# Altium schematic sheet VGA.SchDoc
size A; SheetNumber: 1; SheetTotal: 5
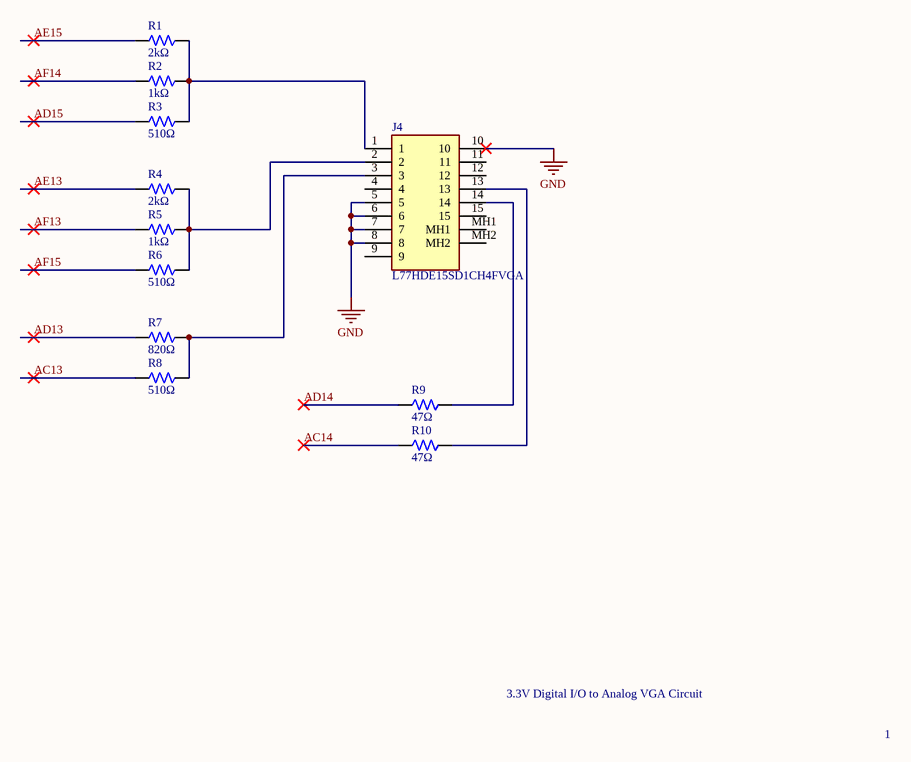
[diagram p0: VGA.SchDoc]

## Parts
J4  L77HDE15SD1CH4FVGA  [L77HDE15SD1CH4FVGA]
R1  Resistance: 2kΩ  [RES-0402]  (hidden comment: 0402WGF2001TCE)
R2  Resistance: 1kΩ  [RES-0402]  (hidden comment: 0402WGF1001TCE)
R3  Resistance: 510Ω  [RES-0402]  (hidden comment: 0402WGF5100TCE)
R4  Resistance: 2kΩ  [RES-0402]  (hidden comment: 0402WGF2001TCE)
R5  Resistance: 1kΩ  [RES-0402]  (hidden comment: 0402WGF1001TCE)
R6  Resistance: 510Ω  [RES-0402]  (hidden comment: 0402WGF5100TCE)
R7  Resistance: 820Ω  [RES-0603]  (hidden comment: 0603WAF8200T5E)
R8  Resistance: 510Ω  [RES-0402]  (hidden comment: 0402WGF5100TCE)
R9  Resistance: 47Ω  [RES-0603]  (hidden comment: 0603WAF470JT5E)
R10  Resistance: 47Ω  [RES-0603]  (hidden comment: 0603WAF470JT5E)

## Nets
GND: J4.5 J4.6 J4.7 J4.8 J4.10
AC13: R8.1
AC14: R10.1
AD13: R7.1
AD14: R9.1
AD15: R3.1
AE13: R4.1
AE15: R1.1
AF13: R5.1
AF14: R2.1
AF15: R6.1
NetJ4_1: J4.1 R1.2 R2.2 R3.2
NetJ4_2: J4.2 R4.2 R5.2 R6.2
NetJ4_3: J4.3 R7.2 R8.2
NetJ4_13: J4.13 R10.2
NetJ4_14: J4.14 R9.2

Not connected (* = marked no-connect by the designer): J4 4 9 11 12 15 MH1 MH2

## Notes on the sheet
- 3.3V Digital I/O to Analog VGA Circuit
- 1

## Library data of the parts
J4 = L77HDE15SD1CH4FVGA: Connector; Manufacturer_Name: Amphenol Communications Solutions; Datasheet Link: https://cdn.amphenol-cs.com/media/wysiwyg/files/drawing/l77hde15sd1ch4fvga.pdf; Height: 12.85mm; Manufacturer_Part_Number: L77HDE15SD1CH4FVGA; Mouser Part Number: 523-7HDE15SD1CH4FVGA; Mouser Price/Stock: https://www.mouser.co.uk/ProductDetail/Amphenol-Commercial-Products/L77HDE15SD1CH4FVGA?qs=ToP8pWlZ0bNtQSp9f8k5Rw%3D%3D; Arrow Part Number: L77HDE15SD1CH4FVGA; Arrow Price/Stock: https://www.arrow.com/en/products/l77hde15sd1ch4fvga/amphenol-fci?region=nac
R1 R4 = 0402WGF2001TCE: Resistor, 2kΩ, ±1%, 62.5mW, 50V, ±100ppm/℃, -55℃~+155℃, SMD 0402; Manufacturer: Uniroyal; Supplier 1: LCSC; Manufacturer Part Number: 0402WGF2001TCE; Supplier Part Number 1: C4109; JLCPCB Part Number: C4109; Power Rating: 62.5mW; Category: Resistors; Package Size: 0402; JLCPCB Basic Part: Yes; Tolerance: ±1%; Voltage Rating: 50V; Temperature Coefficient: ±100ppm/℃; Temperature Rating: -55℃~+155℃; ComponentLink1Description: Datasheet; ComponentLink1URL: https://wmsc.lcsc.com/wmsc/upload/file/pdf/v2/lcsc/2206010230_UNI-ROYAL-Uniroyal-Elec-0402WGF2001TCE_C4109.pdf; ComponentLink2Description: JLCPCB Part URL; ComponentLink2URL: https://jlcpcb.com/partdetail/C4109
R2 R5 = 0402WGF1001TCE: Resistor, 1kΩ, ±1%, 62.5mW, 50V, ±100ppm/℃, -55℃~+155℃, SMD 0402; Manufacturer: Uniroyal; Supplier 1: LCSC; Manufacturer Part Number: 0402WGF1001TCE; Supplier Part Number 1: C11702; JLCPCB Part Number: C11702; Power Rating: 62.5mW; Category: Resistors; Package Size: 0402; JLCPCB Basic Part: Yes; Tolerance: ±1%; Voltage Rating: 50V; Temperature Coefficient: ±100ppm/℃; Temperature Rating: -55℃~+155℃; ComponentLink1Description: Datasheet; ComponentLink1URL: https://wmsc.lcsc.com/wmsc/upload/file/pdf/v2/lcsc/2206010216_UNI-ROYAL-Uniroyal-Elec-0402WGF1001TCE_C11702.pdf; ComponentLink2Description: JLCPCB Part URL; ComponentLink2URL: https://jlcpcb.com/partdetail/C11702
R3 R6 R8 = 0402WGF5100TCE: Resistor, 510Ω, ±1%, 62.5mW, 50V, ±100ppm/℃, -55℃~+155℃, SMD 0402; Manufacturer: Uniroyal; Supplier 1: LCSC; Manufacturer Part Number: 0402WGF5100TCE; Supplier Part Number 1: C25123; JLCPCB Part Number: C25123; Power Rating: 62.5mW; Category: Resistors; Package Size: 0402; JLCPCB Basic Part: Yes; Tolerance: ±1%; Voltage Rating: 50V; Temperature Coefficient: ±100ppm/℃; Temperature Rating: -55℃~+155℃; ComponentLink1Description: Datasheet; ComponentLink1URL: https://wmsc.lcsc.com/wmsc/upload/file/pdf/v2/lcsc/2205311900_UNI-ROYAL-Uniroyal-Elec-0402WGF5100TCE_C25123.pdf; ComponentLink2Description: JLCPCB Part URL; ComponentLink2URL: https://jlcpcb.com/partdetail/C25123
R7 = 0603WAF8200T5E: Resistor, 820Ω, ±1%, 100mW, 75V, ±100ppm/℃, -55℃~+155℃, SMD 0603; Manufacturer: Uniroyal; Supplier 1: LCSC; Manufacturer Part Number: 0603WAF8200T5E; Supplier Part Number 1: C23253; JLCPCB Part Number: C23253; Power Rating: 100mW; Category: Resistors; Package Size: 0603; JLCPCB Basic Part: Yes; Tolerance: ±1%; Voltage Rating: 75V; Temperature Coefficient: ±100ppm/℃; Temperature Rating: -55℃~+155℃; ComponentLink1Description: Datasheet; ComponentLink1URL: https://wmsc.lcsc.com/wmsc/upload/file/pdf/v2/lcsc/2206010100_UNI-ROYAL-Uniroyal-Elec-0603WAF8200T5E_C23253.pdf; ComponentLink2Description: JLCPCB Part URL; ComponentLink2URL: https://jlcpcb.com/partdetail/C23253
R9 R10 = 0603WAF470JT5E: Resistor, 47Ω, ±1%, 100mW, 75V, ±100ppm/℃, -55℃~+155℃, SMD 0603; Manufacturer: Uniroyal; Supplier 1: LCSC; Manufacturer Part Number: 0603WAF470JT5E; Supplier Part Number 1: C23182; JLCPCB Part Number: C23182; Power Rating: 100mW; Category: Resistors; Package Size: 0603; JLCPCB Basic Part: Yes; Tolerance: ±1%; Voltage Rating: 75V; Temperature Coefficient: ±100ppm/℃; Temperature Rating: -55℃~+155℃; ComponentLink1Description: Datasheet; ComponentLink1URL: https://wmsc.lcsc.com/wmsc/upload/file/pdf/v2/lcsc/2206010116_UNI-ROYAL-Uniroyal-Elec-0603WAF470JT5E_C23182.pdf; ComponentLink2Description: JLCPCB Part URL; ComponentLink2URL: https://jlcpcb.com/partdetail/C23182